# EAGLE schematic hub-carrier (EAGLE 7.7.0)
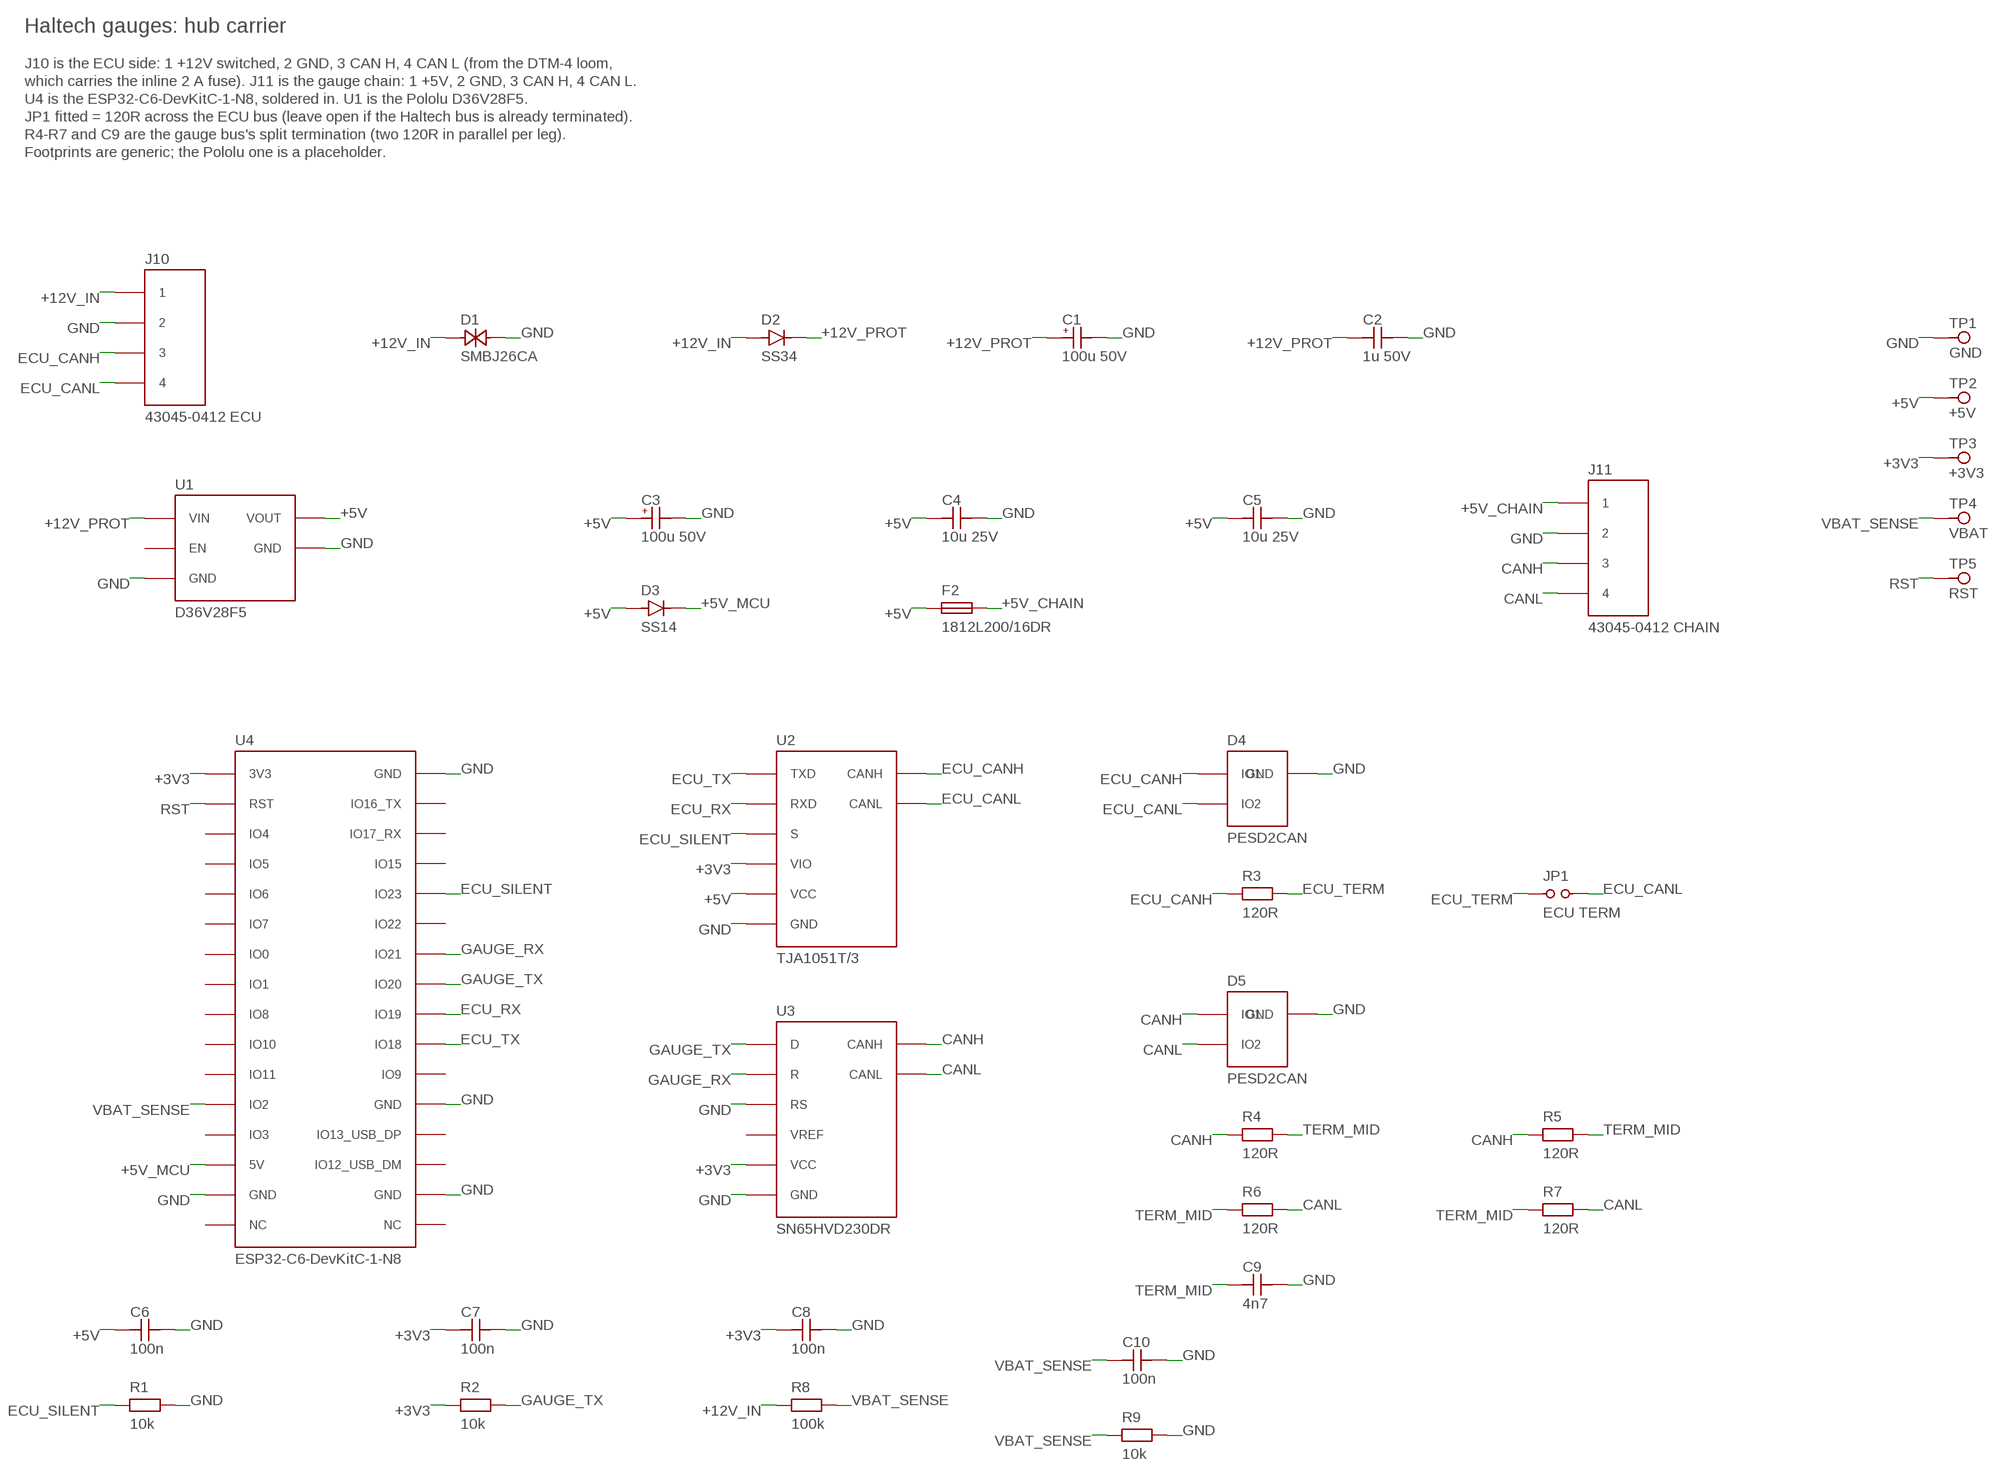
[diagram p0: schematic, sheet 1]

## Parts
C1  100u 50V  CPOL-8X10  [CAP-SMD-8X10]
C2  1u 50V  C0805  [0805]
C3  100u 50V  CPOL-8X10  [CAP-SMD-8X10]
C4  10u 25V  C0805  [0805]
C5  10u 25V  C0805  [0805]
C6  100n  C0805  [0805]
C7  100n  C0805  [0805]
C8  100n  C0805  [0805]
C9  4n7  C0805  [0805]
C10  100n  C0805  [0805]
D1  SMBJ26CA  TVS-SMB  [SMB]
D2  SS34  SCHOTTKY-SMA  [SMA]
D3  SS14  SCHOTTKY-SMA  [SMA]
D4  PESD2CAN  [SOT23]
D5  PESD2CAN  [SOT23]
F2  1812L200/16DR  POLYFUSE-1812  [1812]
J10  43045-0412 ECU  MICROFIT-2X2  [MOLEX-43045-0412]
J11  43045-0412 CHAIN  MICROFIT-2X2  [MOLEX-43045-0412]
JP1  ECU TERM  JUMPER-2  [HDR-1X2]
R1  10k  R0805  [0805]
R2  10k  R0805  [0805]
R3  120R  R1206  [1206]
R4  120R  R1206  [1206]
R5  120R  R1206  [1206]
R6  120R  R1206  [1206]
R7  120R  R1206  [1206]
R8  100k  R0805  [0805]
R9  10k  R0805  [0805]
TP1  GND  TESTPOINT  [TESTPAD]
TP2  +5V  TESTPOINT  [TESTPAD]
TP3  +3V3  TESTPOINT  [TESTPAD]
TP4  VBAT  TESTPOINT  [TESTPAD]
TP5  RST  TESTPOINT  [TESTPAD]
U1  D36V28F5  POLOLU-D36V28F5  [POLOLU-D36V28F-PLACEHOLDER]
U2  TJA1051T/3  TJA1051T-3  [SOIC8]
U3  SN65HVD230DR  SN65HVD230  [SOIC8]
U4  ESP32-C6-DevKitC-1-N8  ESP32-C6-DEVKITC-1  [ESP32-C6-DEVKITC-1]

## Nets
+3V3: C7.1 C8.1 R2.1 TP3.1(TP) U2.5(VIO) U3.3(VCC) U4.J1_1(3V3)
+5V: C3.1(+) C4.1 C5.1 C6.1 D3.2(A) F2.1 TP2.1(TP) U1.VOUT U2.3(VCC)
+5V_CHAIN: F2.2 J11.1
+5V_MCU: D3.1(K) U4.J1_14(5V)
+12V_IN: D1.1 D2.2(A) J10.1 R8.1
+12V_PROT: C1.1(+) C2.1 D2.1(K) U1.VIN
CANH: D5.1(IO1) J11.3 R4.1 R5.1 U3.7(CANH)
CANL: D5.2(IO2) J11.4 R6.2 R7.2 U3.6(CANL)
ECU_CANH: D4.1(IO1) J10.3 R3.1 U2.7(CANH)
ECU_CANL: D4.2(IO2) J10.4 JP1.2 U2.6(CANL)
ECU_RX: U2.4(RXD) U4.J3_9(IO19)
ECU_SILENT: R1.1 U2.8(S) U4.J3_5(IO23)
ECU_TERM: JP1.1 R3.2
ECU_TX: U2.1(TXD) U4.J3_10(IO18)
GAUGE_RX: U3.4(R) U4.J3_7(IO21)
GAUGE_TX: R2.2 U3.1(D) U4.J3_8(IO20)
GND: C1.2(-) C2.2 C3.2(-) C4.2 C5.2 C6.2 C7.2 C8.2 C9.2 C10.2 D1.2 D4.3(GND) D5.3(GND) J10.2 J11.2 R1.2 R9.2 TP1.1(TP) U1.GND1(GND) U1.GND2(GND) U2.2(GND) U3.2(GND) U3.8(RS) U4.J1_15(GND) U4.J3_1(GND) U4.J3_12(GND) U4.J3_15(GND)
RST: TP5.1(TP) U4.J1_2(RST)
TERM_MID: C9.1 R4.2 R5.2 R6.1 R7.1
VBAT_SENSE: C10.1 R8.2 R9.1 TP4.1(TP) U4.J1_12(IO2)
Unconnected: U1.EN U3.5(VREF) U4.J1_3(IO4) U4.J1_4(IO5) U4.J1_5(IO6) U4.J1_6(IO7) U4.J1_7(IO0) U4.J1_8(IO1) U4.J1_9(IO8) U4.J1_10(IO10) U4.J1_11(IO11) U4.J1_13(IO3) U4.J1_16(NC) U4.J3_2(IO16_TX) U4.J3_3(IO17_RX) U4.J3_4(IO15) U4.J3_6(IO22) U4.J3_11(IO9) U4.J3_13(IO13_USB_DP) U4.J3_14(IO12_USB_DM) U4.J3_16(NC)

## Notes on the sheet
- Haltech gauges: hub carrier
- J10 is the ECU side: 1 +12V switched, 2 GND, 3 CAN H, 4 CAN L (from the DTM-4 loom,
- which carries the inline 2 A fuse). J11 is the gauge chain: 1 +5V, 2 GND, 3 CAN H, 4 CAN L.
- U4 is the ESP32-C6-DevKitC-1-N8, soldered in. U1 is the Pololu D36V28F5.
- JP1 fitted = 120R across the ECU bus (leave open if the Haltech bus is already terminated).
- R4-R7 and C9 are the gauge bus's split termination (two 120R in parallel per leg).
- Footprints are generic; the Pololu one is a placeholder.

## Library data of the parts
C1 C3 = haltech-gauges:CPOL-8X10; LCSC: C116241
C2 = haltech-gauges:C0805; LCSC: C28323
C4 C5 = haltech-gauges:C0805; LCSC: C15850
C6-C8 C10 = haltech-gauges:C0805; LCSC: C49678
C9 = haltech-gauges:C0805; LCSC: C1744
D1 = haltech-gauges:TVS-SMB; LCSC: C515606
D2 = haltech-gauges:SCHOTTKY-SMA; LCSC: C8678
D3 = haltech-gauges:SCHOTTKY-SMA; LCSC: C2480
D4 D5 = haltech-gauges:PESD2CAN; LCSC: C75176
F2 = haltech-gauges:POLYFUSE-1812; LCSC: C439873
J10 J11 = haltech-gauges:MICROFIT-2X2
JP1 = haltech-gauges:JUMPER-2
R1 R2 R9 = haltech-gauges:R0805; LCSC: C17414
R3-R7 = haltech-gauges:R1206; LCSC: C17909
R8 = haltech-gauges:R0805; LCSC: C149504
TP1-TP5 = haltech-gauges:TESTPOINT
U1 = haltech-gauges:POLOLU-D36V28F5
U2 = haltech-gauges:TJA1051T-3; LCSC: C38695
U3 = haltech-gauges:SN65HVD230; LCSC: C12084
U4 = haltech-gauges:ESP32-C6-DEVKITC-1